# EAGLE design main (EAGLE 9.5.1)
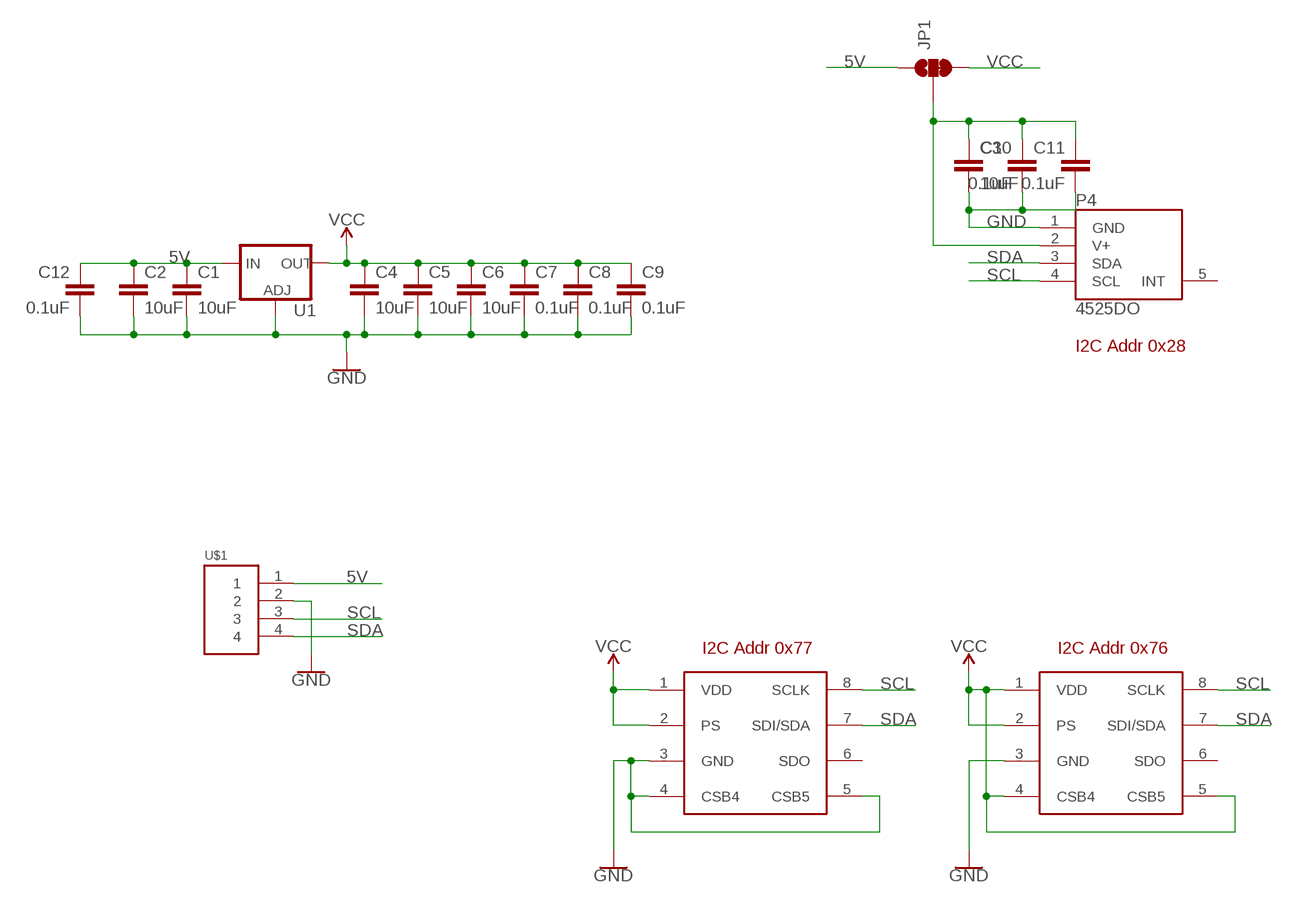
[diagram p0: schematic, sheet 1]

## Parts
C1  10uF  10UF-0805-10V-10%  [0805]
C2  10uF  10UF-0805-10V-10%  [0805]
C3  10uF  10UF-0805-10V-10%  [0805]
C4  10uF  10UF-0805-10V-10%  [0805]
C5  10uF  10UF-0805-10V-10%  [0805]
C6  10uF  10UF-0805-10V-10%  [0805]
C7  0.1uF  0.1UF-0603-25V-5%  [0603]
C8  0.1uF  0.1UF-0603-25V-5%  [0603]
C9  0.1uF  0.1UF-0603-25V-5%  [0603]
C10  0.1uF  0.1UF-0603-25V-5%  [0603]
C11  0.1uF  0.1UF-0603-25V-5%  [0603]
C12  0.1uF  0.1UF-0603-25V-5%  [0603]
JP1  JUMPER-SMT_3_1-NC_TRACE_NO-SILK  [SMT-JUMPER_3_1-NC_TRACE_NO-SILK]
P1  MS5611  [MS5611]
P2  MS5611  [MS5611]
P4  4525DO  MS4525MS4525DO  [DIP1270W53P254L990H762Q8B]
U1  V_REG_317SMD  [SOT223]
U$1  HEADER4VALULOK  [4PINVALULOK]

## Nets
5V: C1.1 C2.1 C12.1 JP1.1 U1.3(IN) U$1.1
GND: C1.2 C2.2 C3.2 C4.2 C5.2 C6.2 C7.2 C8.2 C9.2 C10.2 C11.2 C12.2 P1.3(GND) P1.4(CSB4) P1.5(CSB5) P2.3(GND) P4.1(GND) U1.1(ADJ) U$1.2
N$3: C3.1 C10.1 C11.1 JP1.2 P4.2(V+)
SCL: P1.8(SCLK) P2.8(SCLK) P4.4(SCL) U$1.3
SDA: P1.7(SDI/SDA) P2.7(SDI/SDA) P4.3(SDA) U$1.4
VCC: C4.1 C5.1 C6.1 C7.1 C8.1 C9.1 JP1.3 P1.1(VDD) P1.2(PS) P2.1(VDD) P2.2(PS) P2.4(CSB4) P2.5(CSB5) U1.2(OUT)
Unconnected: P1.6(SDO) P2.6(SDO) P4.5(INT)

## Notes on the sheet
- I2C Addr 0x28
- I2C Addr 0x77 | I2C Addr 0x76

## Library data of the parts
C1-C6 = SparkFun-Capacitors:10UF: 10.0µF ceramic capacitors A capacitor is a passive two-terminal electrical component used to store electrical energy temporarily in an electric field.; PROD_ID: CAP-11330
C7-C12 = SparkFun-Capacitors:0.1UF: 0.1µF ceramic capacitors A capacitor is a passive two-terminal electrical component used to store electrical energy temporarily in an electric field.; PROD_ID: CAP-08604
JP1 = SparkFun-Jumpers:JUMPER-SMT_3_1-NC_TRACE: Normally closed trace jumper (1 of 2 connections) This jumper has a trace between two pads so it's normally closed (NC). The other connection is normally open (NO). Use a razor knife to open the connection. For best results follow the IPC guidelines for cutting traces: Cutout at least 0.063 mm (0.005 in). Remove all loose material to clean up the cut area. Seal the cut with an approved epoxy. Reapply solder to reclose the connection, or to close the NO connection.
P1 P2 = Custom_old:MS5611
P4 = 2020:MS4525
U1 = SparkFun-IC-Power:V_REG_317: Voltage Regulator Standard LM317 adjustable voltage regulator. AOI (Adjust Output Input). Google 'LM317 Calculator' for easy to use app to get the two resistor values needed. 240/720 for 5V output. 240/390 for 3.3V output. Spark Fun Electronics SKU : COM-00527
U$1 = Custom_old:HEADER4

## Board
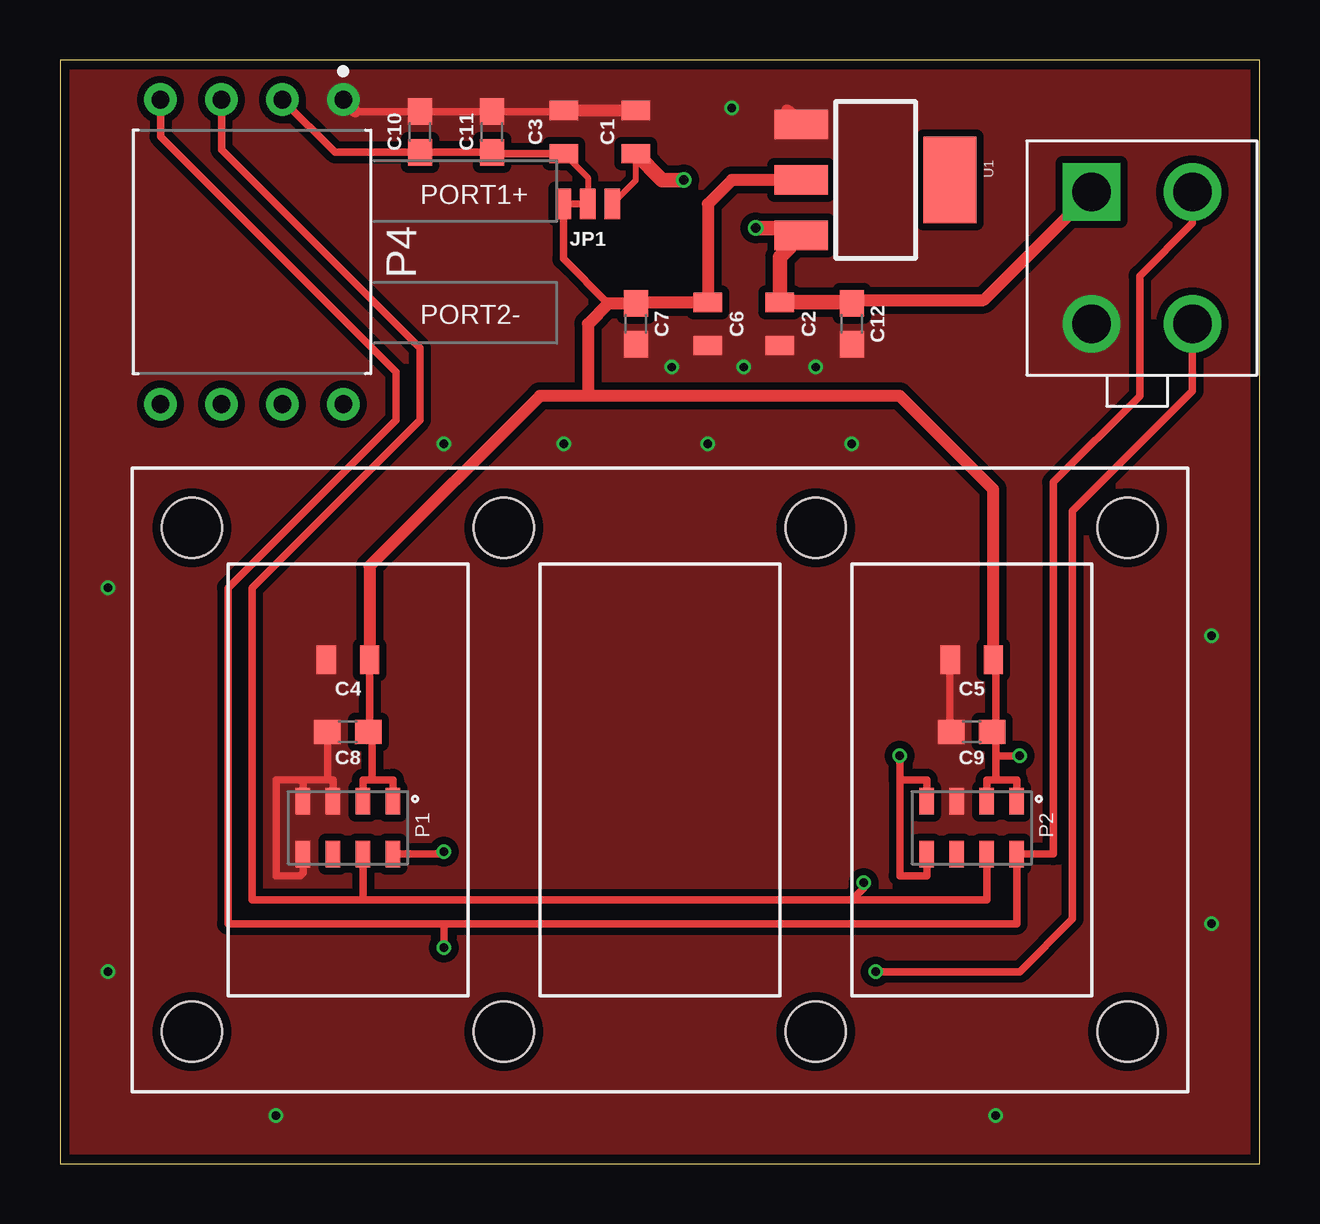
[diagram p1: board, top side]
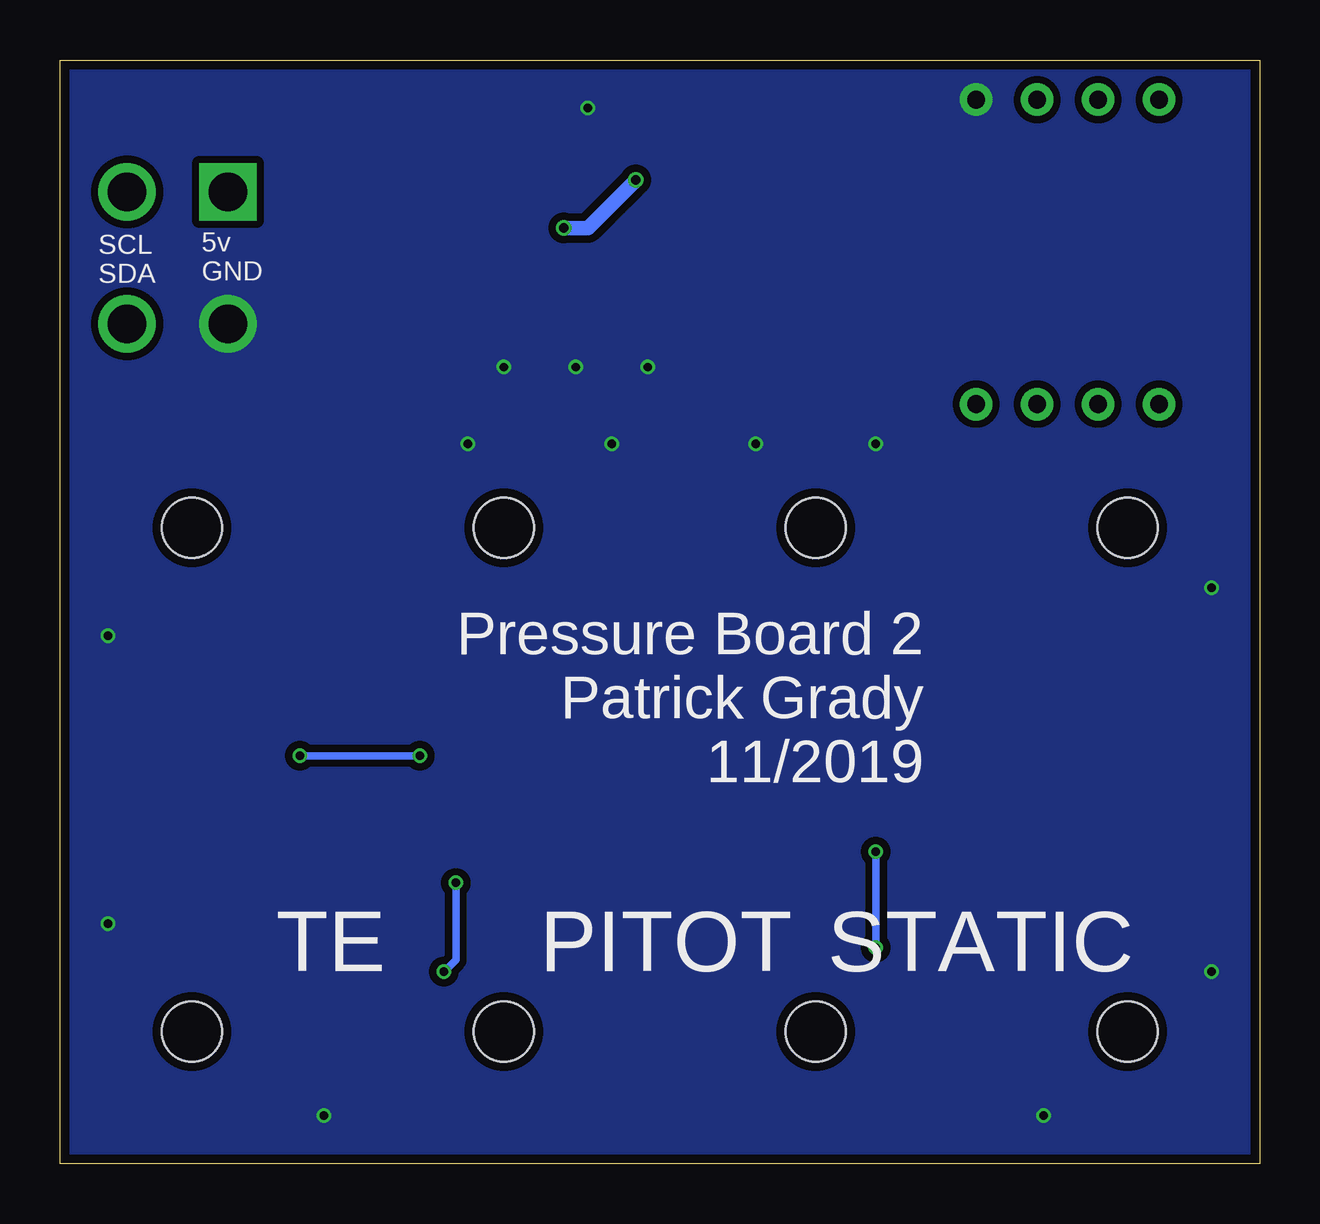
[diagram p2: board, bottom side, seen from below]

Size 50 x 46 mm. Coordinates in mm from the lower left corner, seen from the top.
Outline: 0,0 50,0 50,46 0,46 0,0
Copper layers (1*16): Top 0.035559375mm / dielectric 1.6mm / Bottom 0.035559375mm
Design rules "PATRICK-2lyr": minimum track width 6mil, minimum drill 10mil, track to track 6mil, track to pad 6mil, pad to pad 6mil, via to via 6mil, smd to smd 6mil, copper to edge 15mil, drill to drill 6mil, minimum pad ring 5mil, minimum via ring 5mil, stop-mask expansion 2.5mil, vias tented up to drill 25mil, thermal gap 10mil
Holes 2.5 mm at 5.5,5.5 5.5,26.5 18.5,26.5 31.5,26.5 44.5,26.5 18.5,5.5 31.5,5.5 44.5,5.5

### Footprints (pad centres in the part's own frame; a part is rotated, then mirrored left to right if it is on the bottom)
0805 = smd 0.8 x 1.2: 1 -0.9,0; 2 0.9,0
0603 = smd 1.1 x 1: 1 -0.85,0; 2 0.85,0
SMT-JUMPER_3_1-NC_TRACE_NO-SILK = smd 0.635 x 1.27: 1 -1.016,0; 2 0,0; 3 1.016,0
MS5611 = smd 1.1 x 0.6: 1 -1.1,1.875; 2 -1.1,0.625; 3 -1.1,-0.625; 4 -1.1,-1.875; 5 1.1,-1.875; 6 1.1,-0.625; 7 1.1,0.625; 8 1.1,1.875
DIP1270W53P254L990H762Q8B = drill 0.743 pad 1.343: 1 -6.35,3.81; 2 -6.35,1.27; 3 -6.35,-1.27; 4 -6.35,-3.81; 5 6.35,-3.81; 6 6.35,-1.27; 7 6.35,1.27; 8 6.35,3.81
SOT223 = smd 1.219 x 2.235: 1 -2.311,-3.099; 2 0,-3.099; 3 2.311,-3.099 | smd 3.6 x 2.2: 4 0,3.099
4PINVALULOK = drill 1.6 square: 1 0,5.5 | drill 1.6: 2 0,0; 3 4.2,5.5; 4 4.2,0

### Placement (x,y rotation side)
C1  24,43 90 top
C2  30,35 270 top
C3  21,43 90 top
C4  12,21 180 top
C5  38,21 180 top
C6  27,35 270 top
C7  24,35 270 top
C8  12,18 180 top
C9  38,18 180 top
C10  15,43 90 top
C11  18,43 90 top
C12  33,35 270 top
JP1  22,40 180 top
P1  12,14 270 top
P2  38,14 270 top
P4  8,38 270 top
U1  34,41 270 top
U$1  43,35 0 top

### Tracks (layer width: path | path; a pad name or v marks a point on that pad's centre or on a via)
5V  (via drill 0.4)
  Top 0.254: JP1.1 24,40.98 C1.1
  Top 0.305: C12.1 33,36 33.15,36
  Top 0.508: U$1.1 38.5,36 33.15,36
  Top 0.61: C12.1 32.95,35.9 C2.1 30,37.79 U1.3 30.59,39 v29,39 | C1.1 25.1,41 v26,41
  Bottom 0.61: v26,41 28,39 v29,39
GND  (via drill 0.35)
  Top 0.305: P1.5 10.12,12.12 10,12 9,12 9,16 10,16 | 10,16 10.12,15.88 P1.4 | P1.3 11.38,16 11.15,16 | 11.15,16 10,16 | C8.2 11.15,16 | C5.2 37.1,18 C9.2 | 21.05,43.9 21,43.85 C11.2 C10.2 12.31,43.85
  Top 0.508: 21.05,43.9 C1.2 | 30.31,43.9 U1.1 | P4.1 12.31,43.85
  other vias: 16,30 21,30 25.5,33.2 27,30 33,30 28.5,33.2 31.5,33.2 2,24 2,8 9,2 39,2 48,10 48,22 28,44
  pour Bottom (isolate 0.305, no thermals): -2,48 52,48 52,-2 -2,-2
  pour Top (isolate 0.305, no thermals): -1,47 51,47 51,-1 -1,-1
N$3
  Top 0.254: C3.1 22,41.1 JP1.2
  Top 0.305: C3.1 18.05,42.1 C11.1 C10.1 11.47,42.15 P4.2
SCL  (via drill 0.35)
  Top 0.305: P1.8 16,12.9 v16,13 | v16,9 16,10 | 16,10 39.88,10 P2.8 41.4,12.9 41.4,28.4 45,32 45,37 47.2,39.2 U$1.3 | 16,10 7,10 7,24 14,31 14,33 4.19,42.81 P4.4
  Bottom 0.305: v16,13 v16,9
SDA  (via drill 0.35)
  Top 0.305: P1.7 12.62,11 | P2.7 38.62,11 33,11 | 12.62,11 33,11 | 12.62,11 8,11 8,24 15,31 15,34 6.73,42.27 P4.3 | U$1.4 47.2,32.2 42.2,27.2 42.2,10.2 40,8 v34,8 | v33.5,11.7 33.5,11.5 33,11
  Bottom 0.305: v34,8 33.5,8.5 v33.5,11.7
VCC  (via drill 0.35)
  Top 0.305: P1.2 12.62,16 13,16 | P1.1 13.88,16 13,16 | 13,16 13,18 C8.1 12.9,18 C4.1 | P2.2 38.62,16 39,16 | P2.1 39.88,16 39,16 | C9.1 39,18 | 39,18 39,17 | 39,17 39,16 | C5.1 39,21 39,18 | P2.4 36.12,16 35,16 | 35,16 35,12 36.12,12 P2.5 | 35,16 v35,17 | v40,17 39,17 | JP1.3 20.98,37.72 22.85,35.85
  Top 0.508: C5.1 38.9,28.1 35,32 22,32 | 22,32 20,32 12.9,24.9 C4.1 | U1.2 28,41 27,40 C6.1 24.05,35.9 C7.1 22.85,35.85 22,35 22,32
  Bottom 0.305: v35,17 v40,17

### Text on the board
tPlace: PORT1+ | PORT2-
bPlace: 5v / GND | SCL / SDA | Pressure Board 2 / Patrick Grady / 11/2019 | STATIC | PITOT | TE